# EAGLE design 501_outin_arduino (EAGLE 9.6.2)
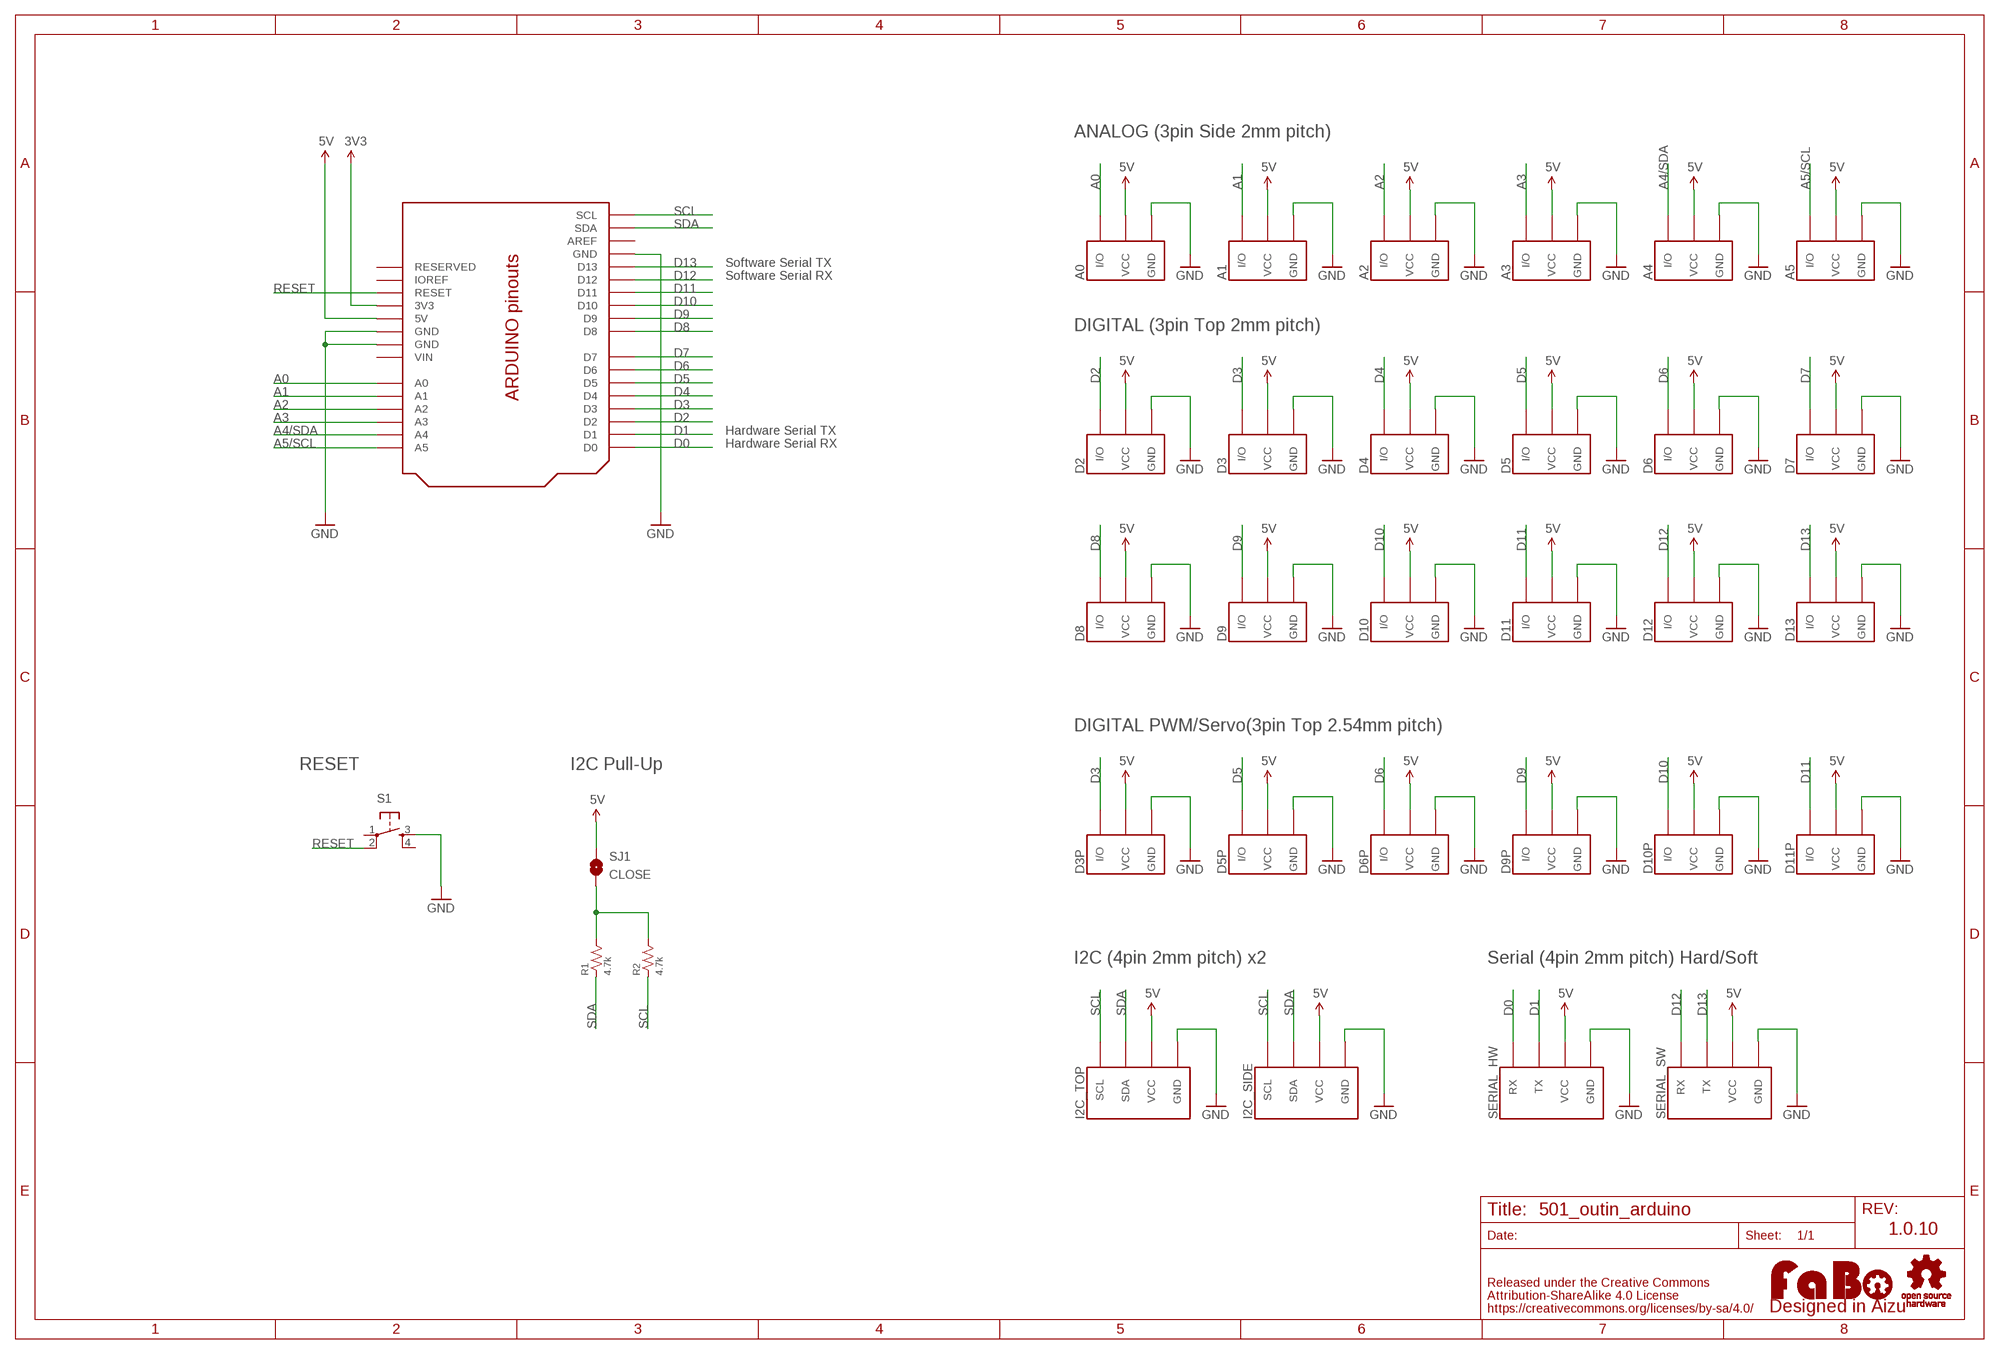
[diagram p0: schematic, sheet 1]

## Parts
A0  FABO_BRICK_3PIN-S03B-PASK-2_LONG  [FABO_BRICK_3PIN_S03B-PASK-2_LONG]
A1  FABO_BRICK_3PIN-S03B-PASK-2_LONG  [FABO_BRICK_3PIN_S03B-PASK-2_LONG]
A2  FABO_BRICK_3PIN-S03B-PASK-2_LONG  [FABO_BRICK_3PIN_S03B-PASK-2_LONG]
A3  FABO_BRICK_3PIN-S03B-PASK-2_LONG  [FABO_BRICK_3PIN_S03B-PASK-2_LONG]
A4  FABO_BRICK_3PIN-S03B-PASK-2_LONG  [FABO_BRICK_3PIN_S03B-PASK-2_LONG]
A5  FABO_BRICK_3PIN-S03B-PASK-2_LONG  [FABO_BRICK_3PIN_S03B-PASK-2_LONG]
D2  FABO_BRICK_3PIN-B03B-PASK-1  [FABO_BRICK_3PIN_B03B-PASK-1]
D3  FABO_BRICK_3PIN-B03B-PASK-1  [FABO_BRICK_3PIN_B03B-PASK-1]
D3P  FABO_BRICK_3PIN-HEADER  [FABO_BRICK_3PIN_HEADER]
D4  FABO_BRICK_3PIN-B03B-PASK-1  [FABO_BRICK_3PIN_B03B-PASK-1]
D5  FABO_BRICK_3PIN-B03B-PASK-1  [FABO_BRICK_3PIN_B03B-PASK-1]
D5P  FABO_BRICK_3PIN-HEADER  [FABO_BRICK_3PIN_HEADER]
D6  FABO_BRICK_3PIN-B03B-PASK-1  [FABO_BRICK_3PIN_B03B-PASK-1]
D6P  FABO_BRICK_3PIN-HEADER  [FABO_BRICK_3PIN_HEADER]
D7  FABO_BRICK_3PIN-B03B-PASK-1  [FABO_BRICK_3PIN_B03B-PASK-1]
D8  FABO_BRICK_3PIN-B03B-PASK-1  [FABO_BRICK_3PIN_B03B-PASK-1]
D9  FABO_BRICK_3PIN-B03B-PASK-1  [FABO_BRICK_3PIN_B03B-PASK-1]
D9P  FABO_BRICK_3PIN-HEADER  [FABO_BRICK_3PIN_HEADER]
D10  FABO_BRICK_3PIN-B03B-PASK-1  [FABO_BRICK_3PIN_B03B-PASK-1]
D10P  FABO_BRICK_3PIN-HEADER  [FABO_BRICK_3PIN_HEADER]
D11  FABO_BRICK_3PIN-B03B-PASK-1  [FABO_BRICK_3PIN_B03B-PASK-1]
D11P  FABO_BRICK_3PIN-HEADER  [FABO_BRICK_3PIN_HEADER]
D12  FABO_BRICK_3PIN-B03B-PASK-1  [FABO_BRICK_3PIN_B03B-PASK-1]
D13  FABO_BRICK_3PIN-B03B-PASK-1  [FABO_BRICK_3PIN_B03B-PASK-1]
I2C_SIDE  FABO_BRICK_I2C-S04B-PASK-2_LONG  [FABO_BRICK_I2C_S04B-PASK-2_LONG]
I2C_TOP  FABO_BRICK_I2C-B04B-PASK-1  [FABO_BRICK_I2C_B04B-PASK-1]
LOGO1  LOGO_FABO-M_BOTTOM  [LOGO_FABO_M_BOTTOM]
R1  4.7k  RESISTOR-0603  [0603]
R2  4.7k  RESISTOR-0603  [0603]
S1  TACT-SWITCH-6MM  [DTS_6_V]
SERIAL_HW  FABO_BRICK_SERIAL-B04B-PASK-1  [FABO_BRICK_SERIAL_B04B-PASK-1]
SERIAL_SW  FABO_BRICK_SERIAL-S04B-PASK-2_LONG  [FABO_BRICK_SERIAL_S04B-PASK-2_LONG]
SJ1  CLOSE  SMD-JUMPER-2-CLOSE  [SMD-JUMPER-2-CLOSE]
U1  ARDUINO_UNO_R3_SHIELD-OUTIN  [ARDUINO_SHIELD_OUTIN]
U$13  LOGO_OSHW-T_M_BOTTOM  [LOGO_OSHW_T_MS_BOTTOM]

## Nets
3V3: U1.3V3
5V: A0.VCC A1.VCC A2.VCC A3.VCC A4.VCC A5.VCC D2.VCC D3.VCC D3P.VCC D4.VCC D5.VCC D5P.VCC D6.VCC D6P.VCC D7.VCC D8.VCC D9.VCC D9P.VCC D10.VCC D10P.VCC D11.VCC D11P.VCC D12.VCC D13.VCC I2C_SIDE.VCC I2C_TOP.VCC SERIAL_HW.VCC SERIAL_SW.VCC SJ1.1 U1.5V
A0: A0.I/O U1.A0
A1: A1.I/O U1.A1
A2: A2.I/O U1.A2
A3: A3.I/O U1.A3
A4/SDA: A4.I/O U1.A4
A5/SCL: A5.I/O U1.A5
D0: SERIAL_HW.RX U1.D0
D1: SERIAL_HW.TX U1.D1
D2: D2.I/O U1.D2
D3: D3.I/O D3P.I/O U1.D3
D4: D4.I/O U1.D4
D5: D5.I/O D5P.I/O U1.D5
D6: D6.I/O D6P.I/O U1.D6
D7: D7.I/O U1.D7
D8: D8.I/O U1.D8
D9: D9.I/O D9P.I/O U1.D9
D10: D10.I/O D10P.I/O U1.D10
D11: D11.I/O D11P.I/O U1.D11
D12: D12.I/O SERIAL_SW.RX U1.D12
D13: D13.I/O SERIAL_SW.TX U1.D13
GND: A0.GND A1.GND A2.GND A3.GND A4.GND A5.GND D2.GND D3.GND D3P.GND D4.GND D5.GND D5P.GND D6.GND D6P.GND D7.GND D8.GND D9.GND D9P.GND D10.GND D10P.GND D11.GND D11P.GND D12.GND D13.GND I2C_SIDE.GND I2C_TOP.GND S1.3 SERIAL_HW.GND SERIAL_SW.GND U1.GND1(GND) U1.GND2(GND) U1.GND3(GND)
N$1: R1.2 R2.2 SJ1.2
RESET: S1.2 U1.RESET
SCL: I2C_SIDE.SCL I2C_TOP.SCL R2.1 U1.SCL
SDA: I2C_SIDE.SDA I2C_TOP.SDA R1.1 U1.SDA
Unconnected: S1.1 S1.4 U1.AREF U1.IOREF U1.RESERVED

## Notes on the sheet
- ANALOG (3pin Side 2mm pitch)
- Software Serial TX
- Software Serial RX
- DIGITAL (3pin Top 2mm pitch)
- Hardware Serial TX
- Hardware Serial RX
- DIGITAL PWM/Servo(3pin Top 2.54mm pitch)
- RESET | I2C Pull-Up
- I2C (4pin 2mm pitch) x2 | Serial (4pin 2mm pitch) Hard/Soft
- 1.0.10

## Power pins joined to a net without a drawn wire
VIN: U1.VIN

## Library data of the parts
A0 A1-A5 D2 D3 D3P D4 D5 D5P D6 D6P D7-D9 D9P D10 D10P D11 D11P D12 D13 = FaBo-Template:FABO_BRICK_3PIN: FaBo Brick 3pin
I2C_SIDE I2C_TOP = FaBo-Template:FABO_BRICK_I2C: FaBo Brick I2C
LOGO1 = component:LOGO_FABO
R1 R2 = FaBo-Resistors:RESISTOR: RESISTOR
S1 = FaBo-Switch:TACT-SWITCH
SERIAL_HW SERIAL_SW = FaBo-Template:FABO_BRICK_SERIAL: FaBo Brick Serial
SJ1 = FaBo-Supply:SMD-JUMPER-2
U1 = FaBo-Boards:ARDUINO_UNO_R3_SHIELD
U$13 = FaBo-etc:LOGO_OSHW

## Board
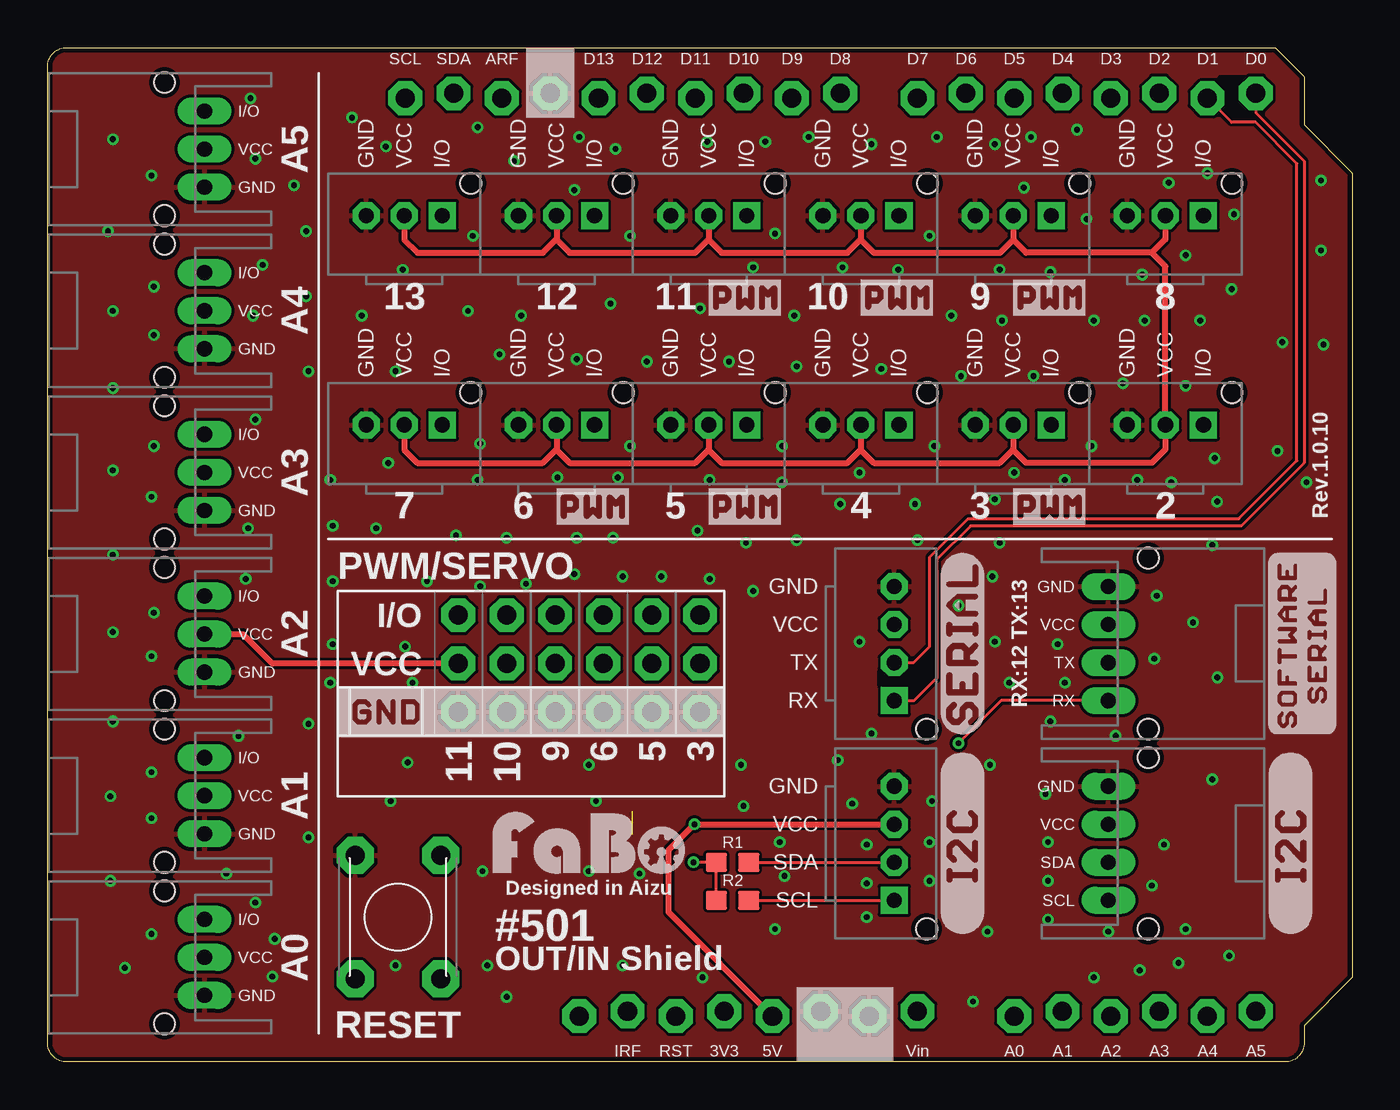
[diagram p1: board, top side]
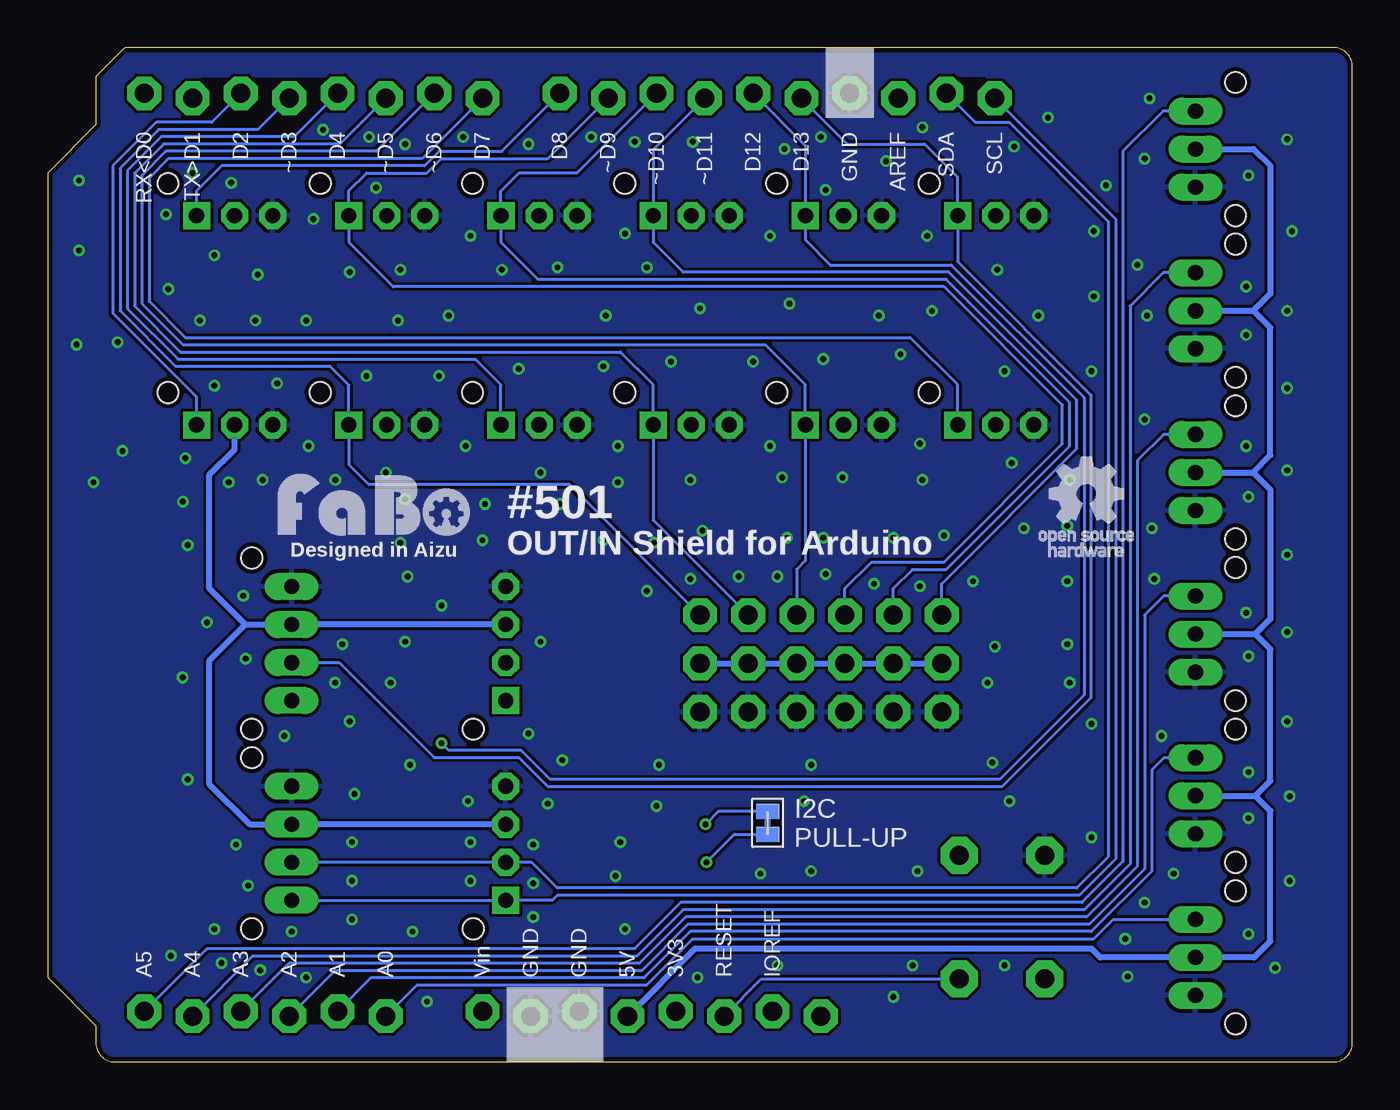
[diagram p2: board, bottom side, seen from below]

Size 68.58 x 53.34 mm. Coordinates in mm from the lower left corner, seen from the top.
Copper layers (1*16): Top 0.035mm / dielectric 1.6mm / Bottom 0.035mm
Design rules "PCBway": minimum track width 6mil, minimum drill 12mil, track to track 6mil, track to pad 6mil, pad to pad 6mil, via to via 6mil, smd to smd 6mil, copper to edge 10mil, drill to drill 10mil, minimum pad ring 10mil, minimum via ring 6mil, stop-mask expansion 2mil, vias tented up to drill 100mil, thermal gap 8mil
tRestrict: area 61.3,51.6 to 63,51.8; area 43.7,19.8 to 43.8,20.6
bRestrict: area 51.8,2 to 52.5,2.2; area 54.1,2 to 54.9,2.2; area 19.3,51.6 to 20.7,51.7; area 54,51.3 to 60.5,51.7

### Footprints (pad centres in the part's own frame; a part is rotated, then mirrored left to right if it is on the bottom)
FABO_BRICK_3PIN_S03B-PASK-2_LONG = drill 0.8 pad 1.422 long: GND -2,0; I/O 2,0; VCC 0,0 | hole 1.1: 3.5,2.1; -3.5,2.1
FABO_BRICK_3PIN_B03B-PASK-1 = drill 0.8 pad 1.422 octagon: GND -2,0; VCC 0,0 | drill 0.8 pad 1.422 square: I/O 2,0 | hole 1.1: 3.5,1.7
FABO_BRICK_3PIN_HEADER = drill 1 pad 1.778 octagon: GND -2.54,0; I/O 2.54,0; VCC 0,0
FABO_BRICK_I2C_S04B-PASK-2_LONG = drill 0.8 pad 1.422 long: GND -3,0; SCL 3,0; SDA 1,0; VCC -1,0 | hole 1.1: 4.5,2.1; -4.5,2.1
FABO_BRICK_I2C_B04B-PASK-1 = drill 0.8 pad 1.422 octagon: GND -3,0; SDA 1,0; VCC -1,0 | drill 0.8 pad 1.422 square: SCL 3,0 | hole 1.1: 4.5,1.7
0603 = smd 1.1 x 1: 1 -0.85,0; 2 0.85,0
DTS_6_V = drill 1 pad 1.93 octagon: 1 -3.25,2.25; 2 3.25,2.25; 3 -3.25,-2.25; 4 3.25,-2.25
FABO_BRICK_SERIAL_B04B-PASK-1 = drill 0.8 pad 1.422 octagon: GND -3,0; TX 1,0; VCC -1,0 | drill 0.8 pad 1.422 square: RX 3,0 | hole 1.1: 4.5,1.7
FABO_BRICK_SERIAL_S04B-PASK-2_LONG = drill 0.8 pad 1.422 long: GND -3,0; RX 3,0; TX 1,0; VCC -1,0 | hole 1.1: 4.5,2.1; -4.5,2.1
SMD-JUMPER-2-CLOSE = smd 0.8 x 1.2: 1 -0.6,0; 2 0.6,0
ARDUINO_SHIELD_OUTIN = drill 1 pad 1.778 octagon: 3V3 35.56,2.667; 5V 38.1,2.413; A0 50.8,2.413; A1 53.34,2.667; A2 55.88,2.413; A3 58.42,2.667; A4 60.96,2.413; A5 63.5,2.667; AREF 23.876,50.673; D0 63.5,50.927; D1 60.96,50.673; D2 58.42,50.927; D3 55.88,50.673; D4 53.34,50.927; D5 50.8,50.673; D6 48.26,50.927; D7 45.72,50.673; D8 41.656,50.927; D9 39.116,50.673; D10 36.576,50.927; D11 34.036,50.673; D12 31.496,50.927; D13 28.956,50.673; GND1 43.18,2.413; GND2 40.64,2.667; GND3 26.416,50.927; IOREF 30.48,2.667; RESERVED 27.94,2.413; RESET 33.02,2.413; SCL 18.796,50.673; SDA 21.336,50.927; VIN 45.72,2.667

### Placement (x,y rotation side)
A0  8.25,5.5 90 top
A1  8.25,14 90 top
A2  8.25,22.5 90 top
A3  8.25,31 90 top
A4  8.25,39.5 90 top
A5  8.25,48 90 top
D2  58.75,33.5 0 top
D3  50.75,33.5 0 top
D3P  34.29,20.95 90 top
D4  42.75,33.5 0 top
D5  34.75,33.5 0 top
D5P  31.75,20.95 90 top
D6  26.75,33.5 0 top
D6P  29.21,20.95 90 top
D7  18.75,33.5 0 top
D8  58.75,44.5 0 top
D9  50.75,44.5 0 top
D9P  26.67,20.95 90 top
D10  42.75,44.5 0 top
D10P  24.13,20.95 90 top
D11  34.75,44.5 0 top
D11P  21.59,20.95 90 top
D12  26.75,44.5 0 top
D13  18.75,44.5 0 top
I2C_SIDE  55.75,11.5 270 top
I2C_TOP  44.5,11.5 270 top
LOGO1  51.44,27.3 0 top
R1  36,10.5 180 top
R2  36,8.5 180 top
S1  18.41,7.62 270 top
SERIAL_HW  44.5,22 270 top
SERIAL_SW  55.75,22 270 top
SJ1  30.73,12.57 90 bottom
U1  0,0 0 top
U$2  [LOGO_SILK_SERIAL2]  49.25,22 90 top
U$3  [LOGO_SILK_SERIAL]  67.75,22 90 top
U$4  [LOGO_SILK_PWM]  50.75,28.25 0 top
U$5  [LOGO_SILK_PWM]  34.75,28.25 0 top
U$6  [LOGO_SILK_PWM]  26.75,28.25 0 top
U$7  [LOGO_SILK_PWM]  50.75,39.25 0 top
U$8  [LOGO_SILK_PWM]  42.75,39.25 0 top
U$9  [LOGO_SILK_PWM]  34.75,39.25 0 top
U$10  [LOGO_FABO_M]  28.45,9.53 0 top
U$11  [LOGO_SILK_I2C]  66.5,11.5 90 top
U$12  [LOGO_SILK_I2C]  49.25,11.5 90 top
U$13  13.97,29.84 0 top
U$19  [LOGO_SILK_GND]  15.88,17.14 0 top

### Tracks (layer width: path | path; a pad name or v marks a point on that pad's centre or on a via)
5V  (via drill 0.3)  (1 unrouted)
  Top 0.152: 42.75,43.23 42.72,43.23 | 34.75,43.23 34.72,43.23 | 26.75,43.23 26.72,43.23 | 50.75,32.18 50.72,32.18 | 42.75,32.18 42.72,32.18 | 34.75,32.18 34.72,32.18 | 26.75,32.18 26.72,32.18
  Top 0.305: 58.04,42.55 51.44,42.55 50.75,43.23 | D8.VCC 58.75,43.26 58.04,42.55 | D9.VCC 50.75,43.23 | D10.VCC 42.75,43.23 43.43,42.55 50.06,42.55 50.75,43.23 | 42.72,43.23 42.04,42.55 35.43,42.55 34.75,43.23 D11.VCC | 34.72,43.23 34.04,42.55 27.43,42.55 26.75,43.23 D12.VCC | 26.72,43.23 26.04,42.55 19.43,42.55 18.75,43.23 D13.VCC | D3.VCC 50.75,32.18 51.44,31.5 58.04,31.5 58.75,32.21 D2.VCC 58.75,41.83 58.04,42.55 | 50.72,32.18 50.04,31.5 43.43,31.5 42.75,32.18 D4.VCC | 42.72,32.18 42.04,31.5 35.43,31.5 34.75,32.18 D5.VCC | 34.72,32.18 34.04,31.5 27.43,31.5 26.75,32.18 D6.VCC | 26.72,32.18 26.04,31.5 19.43,31.5 18.75,32.18 D7.VCC | D11P.VCC 11.81,20.95 10.27,22.5 A2.VCC | U1.5V 32.64,7.87 32.64,11.14 v34,12.5 I2C_TOP.VCC
  Bottom 0.152: 30.73,13.17 33.32,13.17 v34,12.5
  Bottom 0.305: U1.5V 34.54,5.97 13.72,5.97 13.25,5.5 A0.VCC 5.17,5.5 4.32,6.35 4.32,13.21 5.11,14 | 5.11,14 4.32,14.79 4.32,21.72 5.1,22.5 | 5.1,22.5 4.32,23.28 4.32,30.1 5.22,31 | 5.21,39.5 4.32,38.61 4.32,31.9 5.22,31 | D3P.VCC D5P.VCC D6P.VCC D9P.VCC D10P.VCC D11P.VCC | 58.18,23 60.07,24.89 60.07,30.89 58.75,32.21 D2.VCC | 58.18,23 60.07,21.11 60.07,14.61 57.97,12.5 I2C_SIDE.VCC I2C_TOP.VCC | 58.18,23 SERIAL_SW.VCC SERIAL_HW.VCC | A1.VCC 5.11,14 | 5.21,39.5 4.32,40.39 4.32,47.12 5.2,48 A5.VCC | A2.VCC 5.1,22.5 | A3.VCC 5.22,31 | A4.VCC 5.21,39.5
A0
  Bottom 0.152: U1.A0 49.15,4.06 37.08,4.06 34.67,6.48 13.59,6.48 12.57,7.5 A0.I/O
A1
  Bottom 0.152: U1.A1 51.56,4.45 37.21,4.45 34.8,6.86 13.72,6.86 10.54,10.03 10.54,15.37 9.91,16 A1.I/O
A2
  Bottom 0.152: U1.A2 53.47,4.83 37.34,4.83 34.92,7.24 13.84,7.24 10.92,10.16 10.92,23.5 9.92,24.5 A2.I/O
A3
  Bottom 0.152: U1.A3 55.88,5.21 37.47,5.21 35.05,7.62 13.97,7.62 11.3,10.29 11.3,31.62 9.93,33 A3.I/O
A4/SDA
  Bottom 0.152: U1.A4 57.78,5.59 37.59,5.59 35.18,8 14.1,8 11.68,10.41 11.68,39.75 9.94,41.5 A4.I/O
A5/SCL
  Bottom 0.152: U1.A5 60.2,5.97 37.72,5.97 35.31,8.38 14.22,8.38 12.06,10.54 12.06,47.88 9.94,50 A5.I/O
D0
  Top 0.152: SERIAL_HW.RX 45.54,19 46.74,20.19 46.74,26.42 48.51,28.19 62.74,28.19 66.04,31.5 66.04,47.37 63.5,49.91 U1.D0
D1
  Top 0.152: SERIAL_HW.TX 45.51,21 46.35,21.84 46.35,26.54 48.39,28.57 62.61,28.57 65.66,31.62 65.66,47.24 63.5,49.4 62.23,49.4 U1.D1
D2
  Bottom 0.152: U1.D2 59.94,49.4 62.87,49.4 65.15,47.12 65.15,39.37 60.75,34.97 D2.I/O
D3
  Bottom 0.152: U1.D3 57.53,49.02 62.74,49.02 64.77,46.99 64.77,39.5 61.85,36.58 53.72,36.58 52.75,35.6 D3.I/O 52.75,31.41 51.69,30.35 41.15,30.35 D3P.I/O
D4
  Bottom 0.152: U1.D4 55.63,48.64 62.61,48.64 64.39,46.86 64.39,39.62 61.72,36.96 46.1,36.96 44.75,35.61 D4.I/O
D5
  Bottom 0.152: U1.D5 53.21,48.26 62.48,48.26 64.01,46.74 64.01,39.75 61.59,37.34 38.48,37.34 36.75,35.61 D5.I/O 36.75,28.5 D5P.I/O
D6
  Bottom 0.152: U1.D6 51.31,47.88 62.36,47.88 63.63,46.61 63.63,39.88 61.47,37.72 30.86,37.72 28.75,35.61 D6.I/O 28.75,26.37 29.21,25.91 D6P.I/O
D7
  Bottom 0.152: U1.D7 48.9,47.5 62.23,47.5 63.25,46.48 63.25,40.01 61.34,38.1 23.24,38.1 20.75,35.61 D7.I/O
D8
  Bottom 0.152: D8.I/O 60.75,45.8 59.44,47.12 48.77,47.12 48.01,47.88 44.7,47.88 U1.D8
D9
  Bottom 0.152: U1.D9 42.29,47.5 47.88,47.5 48.64,46.74 51.82,46.74 52.75,45.8 D9.I/O 52.75,43.1 50.42,40.77 21.46,40.77 15.24,34.54 15.24,32.51 21.46,26.29 25.27,26.29 26.67,24.89 D9P.I/O
D10
  Bottom 0.152: U1.D10 40.77,46.74 43.81,46.74 44.75,45.8 D10.I/O 44.75,43.1 42.8,41.15 21.34,41.15 14.86,34.67 14.86,32.38 21.34,25.91 23.11,25.91 24.13,24.89 D10P.I/O
D11
  Bottom 0.152: U1.D11 36.75,47.96 D11.I/O 36.75,43.1 35.18,41.53 21.21,41.53 14.48,34.8 14.48,32.26 21.59,25.15 D11P.I/O
D12  (via drill 0.3)
  Top 0.152: SERIAL_SW.RX 50.12,19 v47.88,16.76
  Bottom 0.152: U1.D12 28.75,48.18 D12.I/O 28.75,43.23 27.43,41.91 21.08,41.91 14.1,34.92 14.1,19.3 18.54,14.86 42.16,14.86 43.69,16.38 47.5,16.38 v47.88,16.76
D13
  Bottom 0.152: U1.D13 26.54,48.26 22.48,48.26 20.75,46.53 D13.I/O 20.75,42.09 13.72,35.05 13.72,19.18 18.41,14.48 42.29,14.48 43.81,16 48.26,16 53.26,21 SERIAL_SW.TX
GND  (via drill 0.3)
  other vias: 23.11,5.08 54.1,49.02 51.69,48.64 49.78,48.26 43.31,48.26 37.08,41.78 44.7,41.66 46.74,48.64 30.61,43.43 22.35,43.43 52.45,14.1 37.72,48.39 40.01,48.64 27.94,48.64 12.95,46.1 22.1,39.5 31.5,36.83 39.24,39.24 47.5,39.24 57.66,38.99 35.81,36.83 27.81,36.96 43.81,36.45 51.82,36.07 59.82,35.56 45.59,29.34 37.08,24.77 34.8,25.4 27.81,27.56 39.37,27.43 14.86,30.61 11.3,41.91 10.92,33.78 10.41,25.4 10.03,17.14 10.92,8.38 11.94,6.48 18.29,5.08 30.23,5.08 34.42,4.45 54.99,4.45 57.4,4.83 59.44,5.21 46.35,9.53 46.35,11.56 52.58,9.53 52.58,11.56 43.05,11.43 43.05,9.4 43.05,7.62 53.46,30.6 30.23,25.53 34.8,30.61 21.46,27.69 24.13,3.43 64.64,32.13 57.28,30.61 61.47,29.46 62.36,44.58 62.23,40.64 52.7,17.91 52.58,7.49 62.1,5.59 48.64,3.17 29.72,27.56 22.86,10.03 28.45,10.03 36.7,27.3 17.91,31.5 29.97,30.73 26.8,30.73 41.66,29.34 38.61,30.48 64.9,37.85 60.58,38.99 61.48,20.22 49.4,6.86 5.46,6.73 11.81,4.49 3.3,13.97 3.43,22.61 3.43,31.11 3.43,39.5 3.43,48.51 10.67,50.67 16,49.66 17.78,48.13 29.84,48.01 27.69,45.85 22.61,49.15 13.59,43.69 29.59,39.88 34.29,39.62 18.67,41.66 13.72,36.32 13.72,17.78 14.86,19.94 18.92,15.75 18.03,13.72 61.34,31.75 67.06,37.72 66.17,30.48 66.93,46.35 34.16,27.94 46.61,32.38 50.8,30.99 4.06,4.95 3.3,9.53 5.46,15.24 5.59,23.62 5.59,32.38 5.46,29.72 3.43,26.67 5.46,21.34 3.43,17.91 5.59,40.77 5.59,38.23 3.43,35.43 5.46,46.61 10.92,47.5 10.79,39.24 13.59,40.26 16.51,39.24 18.29,36.32 23.75,37.21 39.37,36.58 48.01,36.07 56.52,35.69 24.51,47.37 34.67,48.39 38.23,43.56 46.35,43.43 41.78,41.78 50.04,41.66 52.7,41.53 57.53,41.4 59.82,42.42 54.61,44.32 54.99,38.99 58.93,46.23 66.93,42.67 61.21,27.18 59.05,30.48 49.66,25.53 50.04,27.3 45.72,27.43 60.2,23.11 58.29,24.51 58.17,21.21 53.09,21.97 53.47,19.94 56.13,17.14 61.21,14.86 58.67,11.43 58.04,9.27 59.82,6.99 55.75,6.86 49.53,15.62 46.48,13.72 42.29,13.59 38.23,6.99 38.48,11.56 38.73,9.78 36.58,13.46 41.53,15.88 28.45,15.62 28.83,13.72 25.15,25.15 27.69,25.65 24.13,27.56 22.73,25.02 19.94,25.27 17.27,28.07 14.99,25.27 18.8,21.84 19.18,19.94 14.99,21.97 14.99,28.19 10.54,28.07 13.72,11.81 9.4,9.91 49.78,29.59 54.86,32.38 42.67,30.99 38.61,32.38 30.61,32.38 22.61,30.61 22.73,32.51 49.78,22.1 47.88,24 50.55,19.94 42.67,22.1 43.31,17.27 31.11,9.91 5.46,12.83 3.17,43.69 50.16,38.99 24.89,39.24 60.96,46.74 51.31,45.97 36.45,15.62 32.26,25.53
  pour Bottom: 0,0 68.58,0 68.58,53.34 0,53.34
  pour Top: 0,0 68.58,0 68.58,53.34 0,53.34
N$1  (via drill 0.3)  (1 unrouted)
  Top 0.152: R2.2 R1.2 v33.95,10.5
  Bottom 0.152: v33.95,10.5 32.48,11.97 30.73,11.97
RESET
  Bottom 0.152: U1.RESET 31.06,4.37 S1.2
SCL
  Top 0.152: R2.1 I2C_TOP.SCL
  Bottom 0.152: U1.SCL 12.45,44.32 12.45,10.67 14.35,8.76 41.78,8.76 42.05,8.5 I2C_TOP.SCL I2C_SIDE.SCL
SDA
  Top 0.152: R1.1 I2C_TOP.SDA
  Bottom 0.152: U1.SDA 19.81,49.4 18.03,49.4 12.83,44.2 12.83,10.79 14.48,9.14 41.78,9.14 43.14,10.5 I2C_TOP.SDA I2C_SIDE.SDA

### Text on the board
tPlace: SCL | SDA | ARF | D13 | D12 | D11 | D10 | D9 | D8 | D7 | D6 | D5 | D4 | D3 | D2 | D1 | D0 | I/O | VCC | GND | VCC | I/O | GND | VCC | I/O | GND | VCC | I/O | GND | VCC | I/O | GND | VCC | I/O | GND | VCC | I/O | GND | I/O | 13 | 12 | 11 | 10 | 9 | 8 | VCC | GND | GND | VCC | I/O | GND | VCC | I/O | GND | VCC | I/O | GND | VCC | I/O | GND | VCC | I/O | GND | VCC | I/O | I/O | VCC | 7 | 6 | 5 | 4 | 3 | 2 | GND | Rev.1.0.10 | PWM/SERVO | GND | GND | I/O | I/O | VCC | VCC | VCC | RX:12 TX:13 | VCC | TX | TX | GND | RX | RX | 11 | 10 | 9 | 6 | 5 | 3 | I/O | VCC | GND | GND | GND | VCC | VCC | Designed in Aizu | SDA | SDA | I/O | SCL | SCL | VCC | #501 | OUT/IN Shield | GND | RESET | IRF | RST | 3V3 | 5V | Vin | A0 | A1 | A2 | A3 | A4 | A5
bPlace: SCL | SDA | AREF | GND | D13 | D12 | ~D11 | ~D10 | ~D9 | D8 | D7 | ~D6 | ~D5 | D4 | ~D3 | D2 | TX>D1 | RX<D0 | #501 | OUT/IN Shield for Arduino | Designed in Aizu | I2C / PULL-UP | IOREF | RESET | 3V3 | 5V | GND | GND | Vin | A0 | A1 | A2 | A3 | A4 | A5